# Altium schematic sheet Sensors.SchDoc
size A4; SheetNumber: 3; SheetTotal: 5
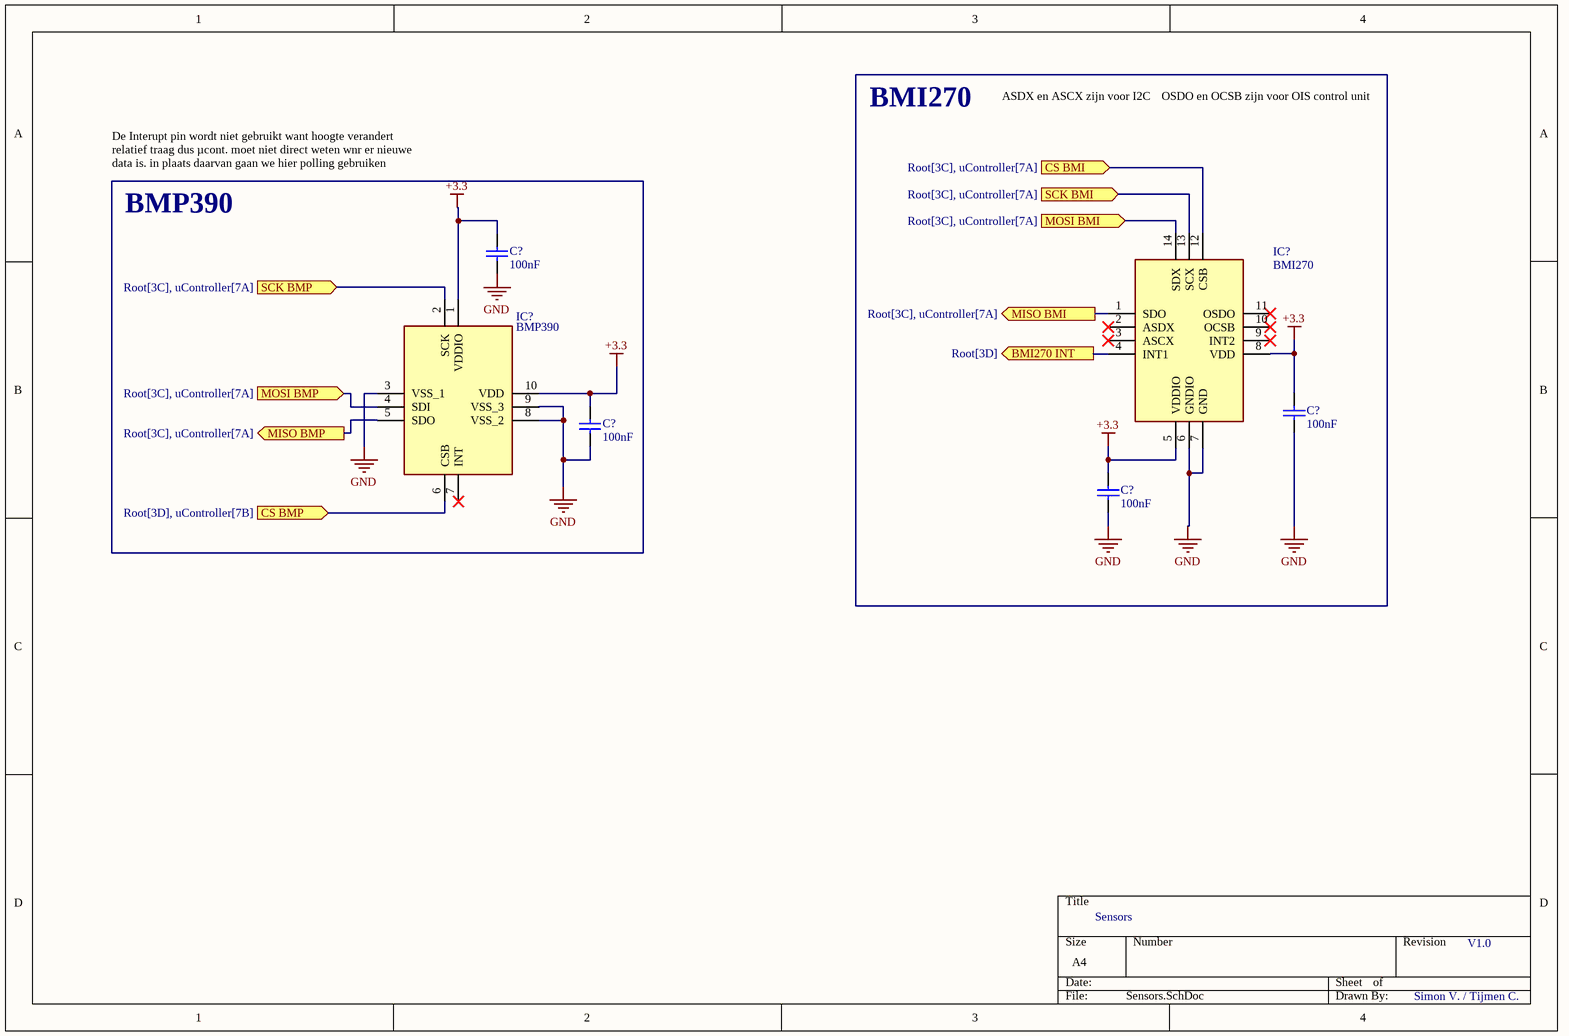
[diagram p0: Sensors.SchDoc]

## Parts
(Parts that share a designator on the sheet are numbered #1, #2 ... from top to bottom, then left to right.)
C?#1  100nF  [CAPC1608X92X38ML15T08]
C?#2  100nF  [CAPC1608X92X38ML15T08]
C?#3  100nF  [CAPC1608X92X38ML15T08]
C?#4  100nF  [CAPC1608X92X38ML15T08]
IC?#1  BMI270  [BMI270]
IC?#2  BMP390  [BMP390]

## Ports
BMI270 INT (out, see Root[3D]), CS BMI (in, see Root[3C], uController[7A]), CS BMP (in, see Root[3D], uController[7B]), MISO BMI (out, see Root[3C], uController[7A]), MISO BMP (out, see Root[3C], uController[7A]), MOSI BMI (in, see Root[3C], uController[7A]), MOSI BMP (in, see Root[3C], uController[7A]), SCK BMI (in, see Root[3C], uController[7A]), SCK BMP (in, see Root[3C], uController[7A])

## Nets
+3.3: C?#1.2 C?#2.2 C?#3.2 C?#4.2 IC?#1.5(VDDIO) IC?#1.8(VDD) IC?#2.1(VDDIO) IC?#2.10(VDD)
GND: C?#1.1 C?#2.1 C?#3.1 C?#4.1 IC?#1.6(GNDIO) IC?#1.7(GND) IC?#2.3(VSS_1) IC?#2.8(VSS_2) IC?#2.9(VSS_3)
BMI270 INT: IC?#1.4(INT1) ; port BMI270 INT
CS BMI: IC?#1.12(CSB) ; port CS BMI
CS BMP: IC?#2.6(CSB) ; port CS BMP
MISO BMI: IC?#1.1(SDO) ; port MISO BMI
MISO BMP: IC?#2.5(SDO) ; port MISO BMP
MOSI BMI: IC?#1.14(SDX) ; port MOSI BMI
MOSI BMP: IC?#2.4(SDI) ; port MOSI BMP
SCK BMI: IC?#1.13(SCX) ; port SCK BMI
SCK BMP: IC?#2.2(SCK) ; port SCK BMP

Not connected (* = marked no-connect by the designer): IC?#1 2(ASDX)* 3(ASCX)* 9(INT2)* 10(OCSB)* 11(OSDO)*; IC?#2 7(INT)*

## Notes on the sheet
- BMI270
- ASDX en ASCX zijn voor I2C
- OSDO en OCSB zijn voor OIS control unit
- De Interupt pin wordt niet gebruikt want hoogte verandert relatief traag dus µcont. moet niet direct weten wnr er nieuwe data is. in plaats daarvan gaan we hier polling gebruiken
- BMP390
- Sensors
- V1.0
- Simon V. / Tijmen C.

## Library data of the parts
C?#1-C?#4 = CMP-2006-01140-1: Part Number: VJ0603Y104MXXAC; Manufacturer: Vitramon
IC?#1 = BMI270: Integrated Circuit; Manufacturer_Name: BOSCH; Datasheet Link: https://www.bosch-sensortec.com/media/boschsensortec/downloads/datasheets/bst-bmi270-ds000.pdf; Height: 0.87mm; Manufacturer_Part_Number: BMI270; Mouser Part Number: 262-BMI270; Mouser Price/Stock: https://www.mouser.co.uk/ProductDetail/Bosch-Sensortec/BMI270?qs=u16ybLDytRYIj%252BjQEee88A%3D%3D; Arrow Part Number: BMI270; Arrow Price/Stock: https://www.arrow.com/en/products/bmi270/bosch-sensortec?utm_currency=USD&region=europe
IC?#2 = BMP390: Integrated Circuit; Manufacturer_Name: BOSCH; Datasheet Link: https://www.bosch-sensortec.com/media/boschsensortec/downloads/datasheets/bst-bmp390-ds002.pdf; Height: 0.8mm; Manufacturer_Part_Number: BMP390; Mouser Part Number: 262-BMP390; Mouser Price/Stock: https://www.mouser.co.uk/ProductDetail/Bosch-Sensortec/BMP390?qs=QNEnbhJQKvYQVfvRMgo2YA%3D%3D; Arrow Part Number: BMP390; Arrow Price/Stock: https://www.arrow.com/en/products/bmp390/bosch-sensortec?utm_currency=USD&region=nac